# Altium schematic sheet BC127.SchDoc
size A4; DocumentNumber: 2; SheetNumber: 2; SheetTotal: 6
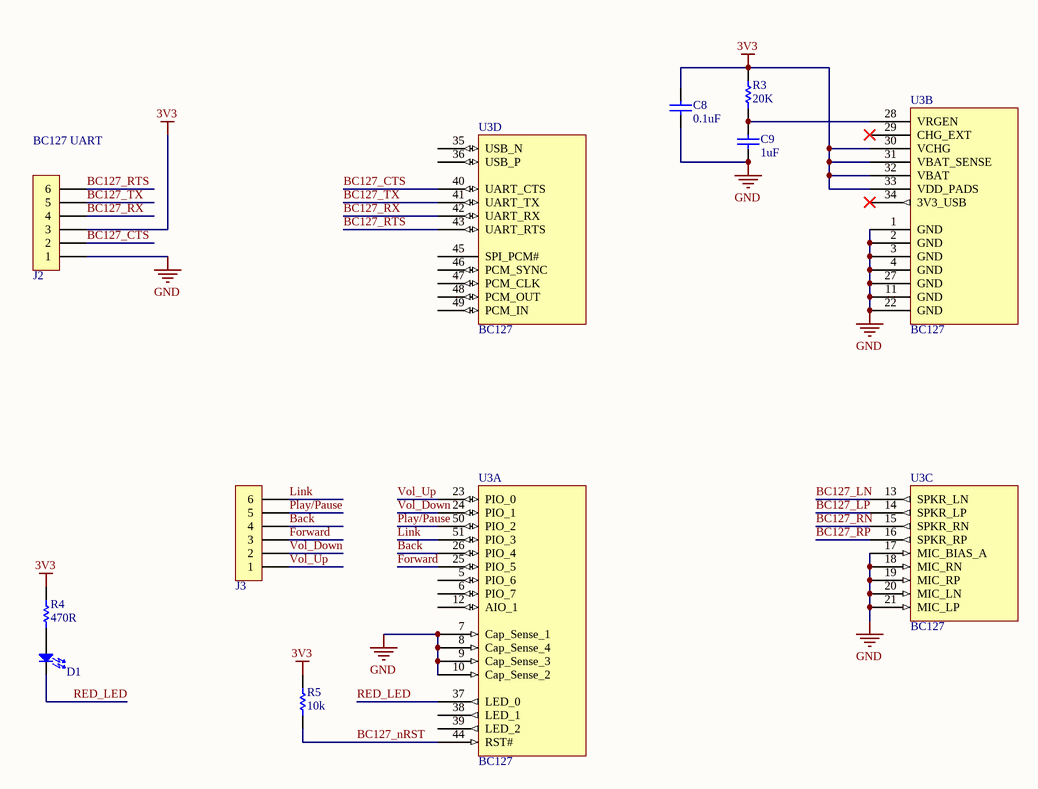
[diagram p0: BC127.SchDoc]

## Parts
C8  0.1uF  [CAPC1608X09N]
C9  1uF  [CAPC1608X09N]
D1  LED 0603  [DIOM1608X08N]  (value not drawn)
J2  6POS THRU HOLE 2.0MM  [JST PH-6]  (value not drawn)
J3  6POS THRU HOLE 2.0MM  [JST PH-6]  (value not drawn)
R3  20K  [RESC1608X06N]
R4  470R  [RESC1608X06N]
R5  10k  [RESC1608X06N]
U3  BC127  [BC127]  (parts A,B,C,D of 4)

## Nets
3V3: C8.2 J2.3 R3.2 R4.2 R5.2 U3.30(VCHG) U3.31(VBAT_SENSE) U3.32(VBAT) U3.33(VDD_PADS)
GND: C8.1 C9.1 J2.1 U3.1(GND) U3.2(GND) U3.3(GND) U3.4(GND) U3.7(Cap_Sense_1) U3.8(Cap_Sense_4) U3.9(Cap_Sense_3) U3.10(Cap_Sense_2) U3.11(GND) U3.17(MIC_BIAS_A) U3.18(MIC_RN) U3.19(MIC_RP) U3.20(MIC_LN) U3.21(MIC_LP) U3.22(GND) U3.27(GND)
Back: J3.4 U3.26(PIO_4)
BC127_CTS: J2.2 U3.40(UART_CTS)
BC127_LN: U3.13(SPKR_LN)
BC127_LP: U3.14(SPKR_LP)
BC127_nRST: R5.1 U3.44(RST#)
BC127_RN: U3.15(SPKR_RN)
BC127_RP: U3.16(SPKR_RP)
BC127_RTS: J2.6 U3.43(UART_RTS)
BC127_RX: J2.4 U3.42(UART_RX)
BC127_TX: J2.5 U3.41(UART_TX)
Forward: J3.3 U3.25(PIO_5)
Link: J3.6 U3.51(PIO_3)
Play/Pause: J3.5 U3.50(PIO_2)
RED_LED: D1.1(K2) U3.37(LED_0)
Vol_Down: J3.2 U3.24(PIO_1)
Vol_Up: J3.1 U3.23(PIO_0)
NetC9_2: C9.2 R3.1 U3.28(VRGEN)
NetD1_2: D1.2(A2) R4.1

Not connected (* = marked no-connect by the designer): U3 5(PIO_6) 6(PIO_7) 12(AIO_1) 29(CHG_EXT)* 34(3V3_USB)* 35(USB_N) 36(USB_P) 38(LED_1) 39(LED_2) 45(SPI_PCM#) 46(PCM_SYNC) 47(PCM_CLK) 48(PCM_OUT) 49(PCM_IN)

## Notes on the sheet
- (near J2) BC127 UART

## Library data of the parts
C8 = CAP CER 0.1uF 0603: Voltage: 50V; Rating: X7R; Tolerance: 10%; Value: 0.1uF; Digikey Part Number: 490-1519-1-ND; Package: 0603
C9 = CAP CER 1uF 0603: Manufacturer: Murata; Manufacturer Part Number: GRM188R7YA105KA12D; Voltage: 35V; Rating: X7R; Tolerance: 10%; Value: 1uF; Digikey Part Number: 490-10487-1-ND
D1 = LED 0603: Voltage: 2.2V; Configuration: Single; Current: 20mA; Footprint: 0603; Temperature: 85dC; Digikey Part Number: 160-1447-1-ND
R3 = RES 20K 0603: Tolerance: 1%; Power: 0.1W; Footprint: 0603; Value: 20K; Digikey Part Number: 311-20.0KHRCT-ND
R4 = RES 470R 0603: Tolerance: 1%; Power: 0.25W; Type: RES; Footprint: 0603; Value: 470R; Digikey Part Number: 311-470HRCT-ND
R5 = RES 10K 0603: Manufacturer: Yageo; Manufacturer Part Number: RC0603FR-0710KL; Tolerance: 1%; Power: 0.1W; Type: RES; Footprint: 0603; Temperature: 155dC; Digikey Part Number: 311-10.0KHRCT-ND; Value: 10k
J2 J3 = 6POS THRU HOLE 2.0MM: Digikey Part Number: 455-1708-ND